# Altium schematic sheet Microcontroller.SchDoc
size A3; SheetNumber: 4; SheetTotal: 5
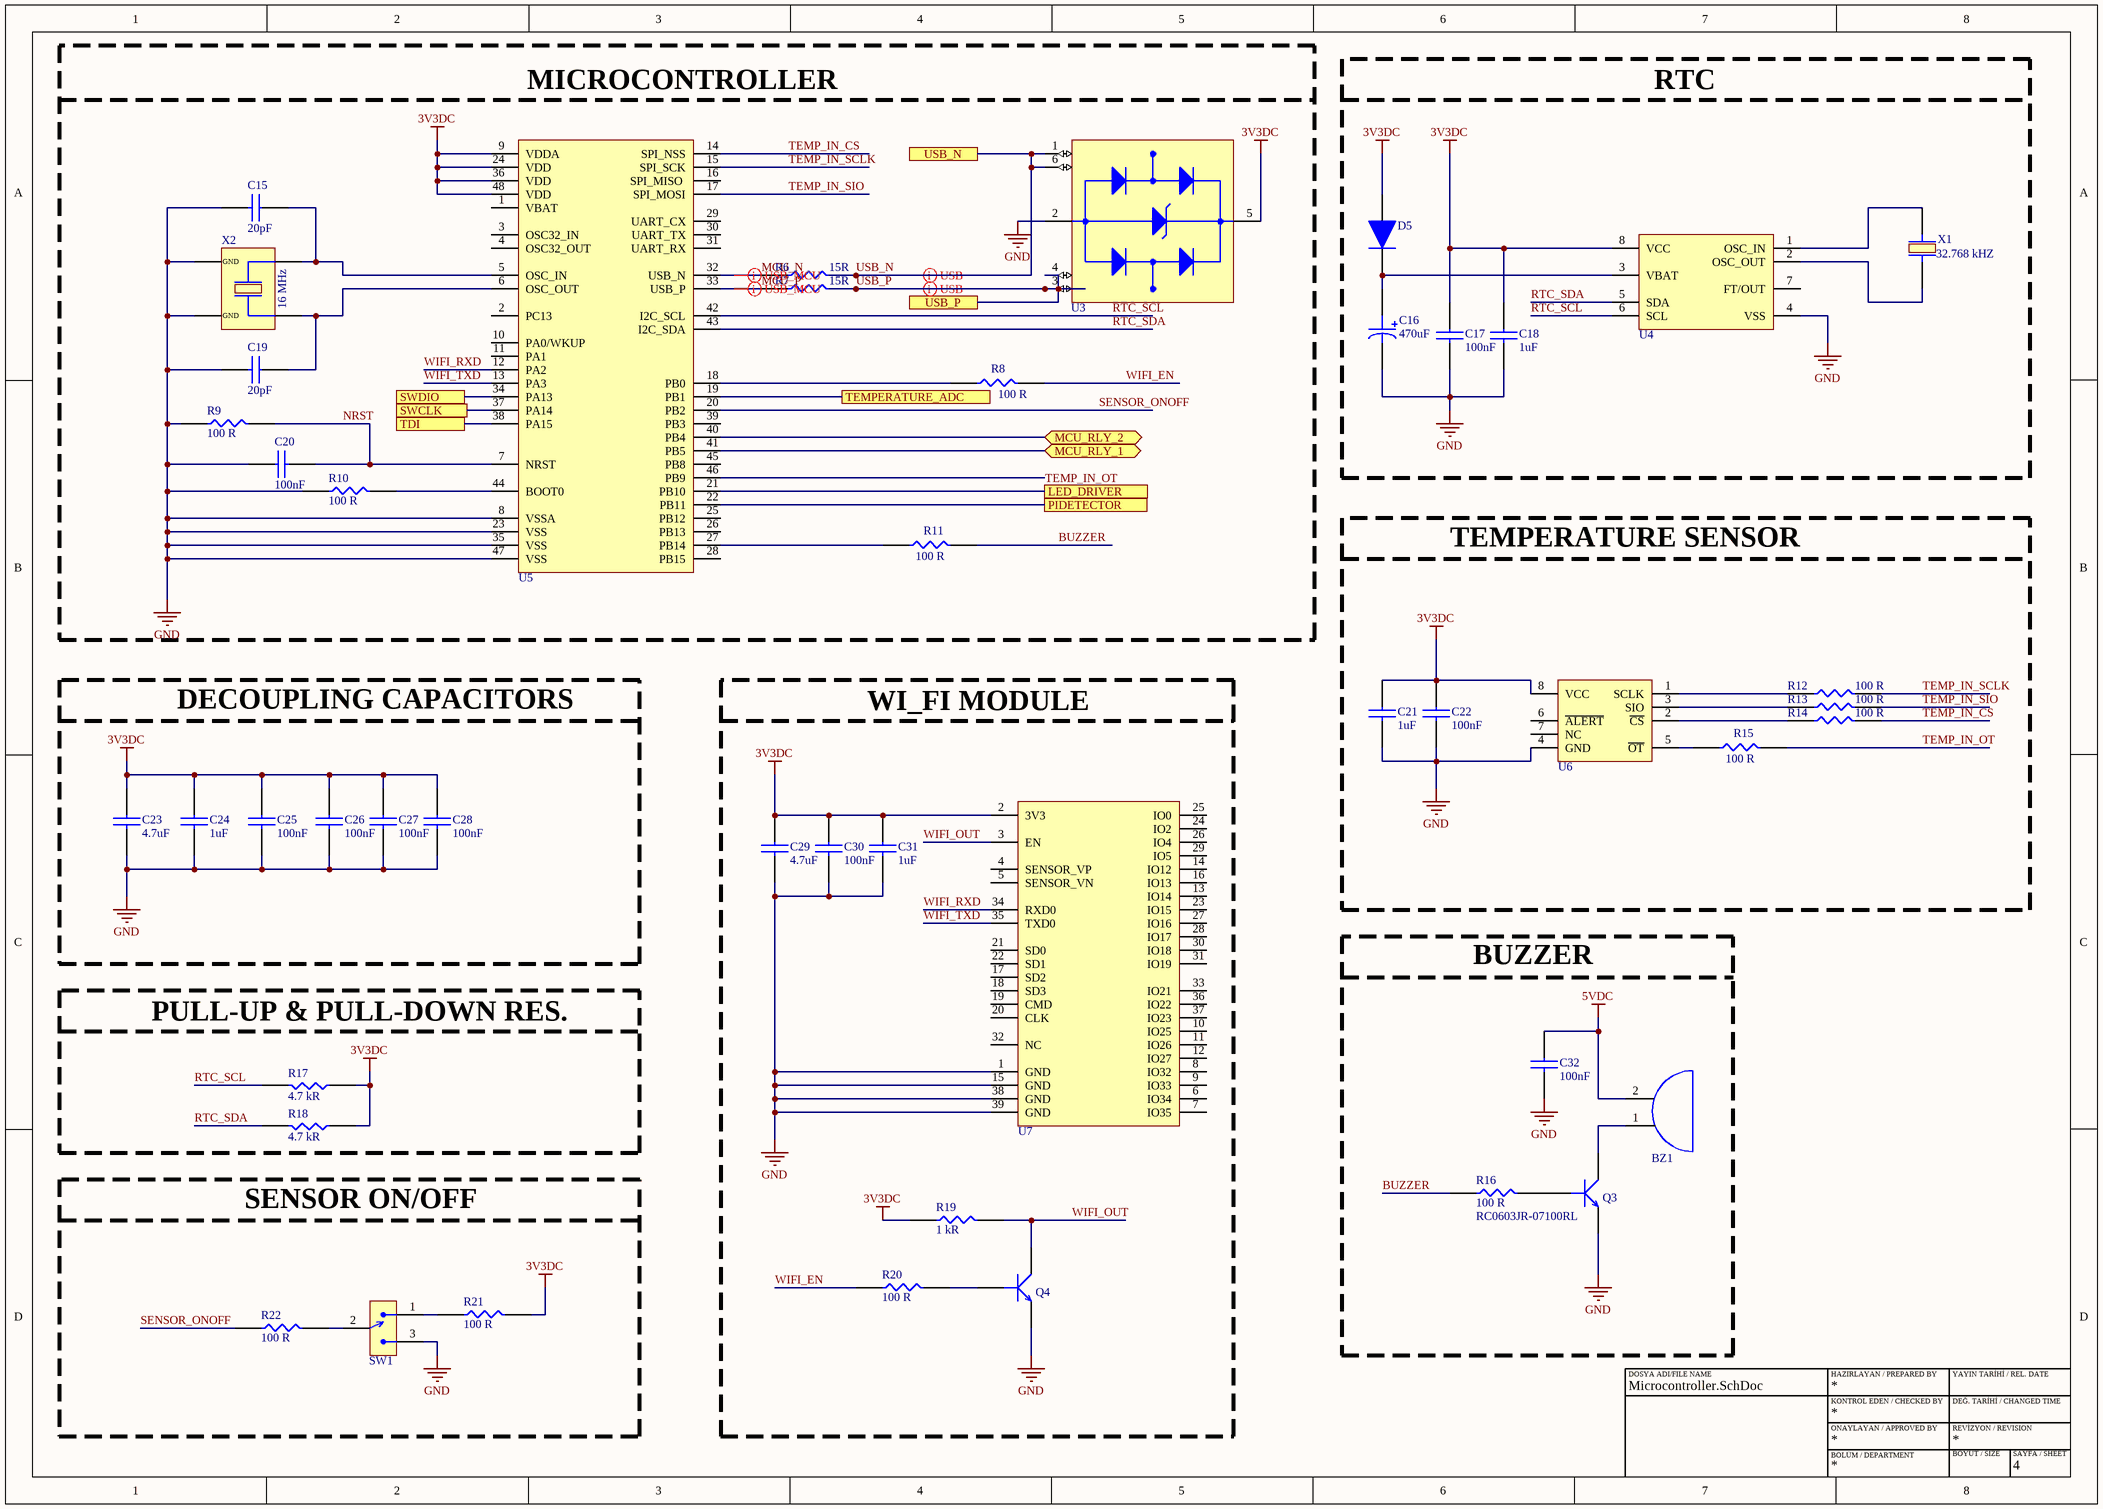
[diagram p0: Microcontroller.SchDoc]

## Parts
BZ1  CMI-9605IC-0580T  [CMI-9605IC-0580T]  (value not drawn)
C15  value 20pF  [CAP_0603]  (hidden comment: CL10C200JB8NNNC)
C16  value 470uF  [CAP_RADIAL_D10_P5]  (hidden comment: ESH477M050AH4AA)
C17  value 100nF  [CAP_0805]  (hidden comment: CL21B104KBCNNNC)
C18  value 1uF  [CAP_0805]  (hidden comment: CL21B105KBFNNNE)
C19  value 20pF  [CAP_0603]  (hidden comment: CL10C200JB8NNNC)
C20  value 100nF  [CAP_0805]  (hidden comment: CL21B104KBCNNNC)
C21  value 1uF  [CAP_0805]  (hidden comment: CL21B105KBFNNNE)
C22  value 100nF  [CAP_0805]  (hidden comment: CL21B104KBCNNNC)
C23  value 4.7uF  [CAP_0805]  (hidden comment: CL21A475KAQNNNE)
C24  value 1uF  [CAP_0805]  (hidden comment: CL21B105KBFNNNE)
C25  value 100nF  [CAP_0805]  (hidden comment: CL21B104KBCNNNC)
C26  value 100nF  [CAP_0805]  (hidden comment: CL21B104KBCNNNC)
C27  value 100nF  [CAP_0805]  (hidden comment: CL21B104KBCNNNC)
C28  value 100nF  [CAP_0805]  (hidden comment: CL21B104KBCNNNC)
C29  value 4.7uF  [CAP_0805]  (hidden comment: CL21A475KAQNNNE)
C30  value 100nF  [CAP_0805]  (hidden comment: CL21B104KBCNNNC)
C31  value 1uF  [CAP_0805]  (hidden comment: CL21B105KBFNNNE)
C32  value 100nF  [CAP_0805]  (hidden comment: CL21B104KBCNNNC)
D5  1N4148WS  [SOD323F]  (value not drawn)
Q3  MMBT3904.7.F  [SOT-23F]  (value not drawn)
Q4  MMBT3904.7.F  [SOT-23F]  (value not drawn)
R6  value 15R  [RES_0603]  (hidden comment: RC0603JR-0715RL)
R7  value 15R  [RES_0603]  (hidden comment: RC0603JR-0715RL)
R8  value 100 R  [RES_0603]  (hidden comment: RC0603JR-07100RL)
R9  value 100 R  [RES_0603]  (hidden comment: RC0603JR-07100RL)
R10  value 100 R  [RES_0603]  (hidden comment: RC0603JR-07100RL)
R11  value 100 R  [RES_0603]  (hidden comment: RC0603JR-07100RL)
R12  value 100 R  [RES_0603]  (hidden comment: RC0603JR-07100RL)
R13  value 100 R  [RES_0603]  (hidden comment: RC0603JR-07100RL)
R14  value 100 R  [RES_0603]  (hidden comment: RC0603JR-07100RL)
R15  value 100 R  [RES_0603]  (hidden comment: RC0603JR-07100RL)
R16  RC0603JR-07100RL  value 100 R  [RES_0603]
R17  value 4.7 kR  [RES_0603]  (hidden comment: RC0603FR-074K7L)
R18  value 4.7 kR  [RES_0603]  (hidden comment: RC0603FR-074K7L)
R19  value 1 kR  [RES_0603]  (hidden comment: RMCF0603FT1K00)
R20  value 100 R  [RES_0603]  (hidden comment: RC0603JR-07100RL)
R21  value 100 R  [RES_0603]  (hidden comment: RC0603JR-07100RL)
R22  value 100 R  [RES_0603]  (hidden comment: RC0603JR-07100RL)
SW1  EG1215AA  [EG1215AA]  (value not drawn)
U3  USBLC6-2SC6  [SOT23-6L]  (value not drawn)
U4  M41T00M6F  [SOIC-8]  (value not drawn)
U5  STM32F103C6T6A  [LQFP-48]  (value not drawn)
U6  MAX6662MSA+  [SOIC-8]  (value not drawn)
U7  ESP32-WROOM-32E  [ESP32-32E]  (value not drawn)
X1  Operating Frequency-Nom: 32.768 kHZ  [ABS05]  (hidden comment: ABS05-32.768KHZ-T)
X2  Operating Frequency-Nom: 16 MHz  [ECS]  (hidden comment: ECS-160-20-30B-TR)

## Blocks framed on the sheet
MICROCONTROLLER: C15 C19 C20 R6-R11 U3 U5 X2
RTC: C16-C18 D5 U4 X1
TEMPERATURE SENSOR: C21 C22 R12-R15 U6
DECOUPLING CAPACITORS: C23-C28
WI_FI MODULE: C29-C31 Q4 R19 R20 U7
PULL-UP & PULL-DOWN RES.: R17 R18
BUZZER: BZ1 C32 Q3 R16
SENSOR ON/OFF: R21 R22 SW1

## Ports
LED_DRIVER, MCU_RLY_1 (bidir), MCU_RLY_2 (bidir), PIDETECTOR, SWCLK, SWDIO, TDI, TEMPERATURE_ADC, USB_N, USB_P

## Nets
3V3DC: C17.2 C18.2 C21.2 C22.2 C23.2 C24.2 C25.2 C26.2 C27.2 C28.2 C29.2 C30.2 C31.2 D5.2 R17.2 R18.2 R19.1 R21.2 U3.5(VBUS) U4.8(VCC) U5.9(VDDA) U5.24(VDD) U5.36(VDD) U5.48(VDD) U6.8(VCC) U7.2(3V3)
5VDC: BZ1.2 C32.2
GND: C15.1 C16.2 C17.1 C18.1 C19.1 C20.2 C21.1 C22.1 C23.1 C24.1 C25.1 C26.1 C27.1 C28.1 C29.1 C30.1 C31.1 C32.1 Q3.2(E) Q4.2(E) R9.1 R10.1 SW1.3 U3.2(GND) U4.4(VSS) U5.8(VSSA) U5.23(VSS) U5.35(VSS) U5.47(VSS) U6.4(GND) U7.1(GND) U7.15(GND) U7.38(GND) U7.39(GND) X2.2(GND) X2.4(GND)
BUZZER: R11.2 R16.1
LED_DRIVER: U5.21(PB10) ; port LED_DRIVER
MCU_N: R6.1 U5.32(USB_N)
MCU_P: R7.1 U5.33(USB_P)
MCU_RLY_1: U5.41(PB5) ; port MCU_RLY_1
MCU_RLY_2: U5.40(PB4) ; port MCU_RLY_2
NRST: C20.1 R9.2 U5.7(NRST)
PIDETECTOR: U5.22(PB11) ; port PIDETECTOR
RTC_SCL: R17.1 U4.6(SCL) U5.42(I2C_SCL)
RTC_SDA: R18.1 U4.5(SDA) U5.43(I2C_SDA)
SENSOR_ONOFF: R22.1 U5.20(PB2)
SWCLK: U5.37(PA14) ; port SWCLK
SWDIO: U5.34(PA13) ; port SWDIO
TDI: U5.38(PA15) ; port TDI
TEMP_IN_CS: R14.2 U5.14(SPI_NSS)
TEMP_IN_OT: R15.2 U5.46(PB9)
TEMP_IN_SCLK: R12.2 U5.15(SPI_SCK)
TEMP_IN_SIO: R13.2 U5.17(SPI_MOSI)
TEMPERATURE_ADC: U5.19(PB1) ; port TEMPERATURE_ADC
USB_N: R6.2 U3.1(I/O1_IN) U3.6(I/O1_OUT) ; port USB_N
USB_P: R7.2 U3.3(I/O2_IN) U3.4(I/O2_OUT) ; port USB_P
WIFI_EN: R8.2 R20.1
WIFI_OUT: Q4.3(C) R19.2 U7.3(EN)
WIFI_RXD: U5.12(PA2) U7.34(RXD0)
WIFI_TXD: U5.13(PA3) U7.35(TXD0)
NetBZ1_1: BZ1.1 Q3.3(C)
NetC15_2: C15.2 U5.5(OSC_IN) X2.3
NetC16_1: C16.1 D5.1 U4.3(VBAT)
NetC19_2: C19.2 U5.6(OSC_OUT) X2.1
NetQ3_1: Q3.1(B) R16.2
NetQ4_1: Q4.1(B) R20.2
NetR8_1: R8.1 U5.18(PB0)
NetR10_2: R10.2 U5.44(BOOT0)
NetR11_1: R11.1 U5.27(PB14)
NetR12_1: R12.1 U6.1(SCLK)
NetR13_1: R13.1 U6.3(SIO)
NetR14_1: R14.1 U6.2(~{CS})
NetR15_1: R15.1 U6.5(~{OT})
NetR21_1: R21.1 SW1.1
NetR22_2: R22.2 SW1.2
NetU4_1: U4.1(OSC_IN) X1.2
NetU4_2: U4.2(OSC_OUT) X1.1

Not connected (* = marked no-connect by the designer): U4 7(FT/OUT); U5 1(VBAT) 2(PC13) 3(OSC32_IN) 4(OSC32_OUT) 10(PA0/WKUP) 11(PA1) 16(SPI_MISO_) 25(PB12) 26(PB13) 28(PB15) 29(UART_CX) 30(UART_TX) 31(UART_RX) 39(PB3) 45(PB8); U6 6(~{ALERT}) 7(NC); U7 4(SENSOR_VP) 5(SENSOR_VN) 6(IO34) 7(IO35) 8(IO32) 9(IO33) 10(IO25) 11(IO26) 12(IO27) 13(IO14) 14(IO12) 16(IO13) 17(SD2) 18(SD3) 19(CMD) 20(CLK) 21(SD0) 22(SD1) 23(IO15) 24(IO2) 25(IO0) 26(IO4) 27(IO16) 28(IO17) 29(IO5) 30(IO18) 31(IO19) 32(NC) 33(IO21) 36(IO22) 37(IO23)

## Layout directives
differential pair: MCU_N, MCU_P, USB_N, USB_P

## Notes on the sheet
- DOSYA ADI/FILE NAME
- HAZIRLAYAN / PREPARED BY
- YAYIN TARİHİ / REL. DATE
- KONTROL EDEN / CHECKED BY
- ONAYLAYAN / APPROVED BY
- BÖLÜM / DEPARTMENT
- DEĞ. TARİHİ / CHANGED TIME
- REVİZYON / REVISION
- BOYUT / SIZE
- SAYFA / SHEET

## Library data of the parts
BZ1 = CMI-9605IC-0580T: Buzzers Indicator, Internally Driven Magnetic 5 V 30mA 2.7kHz 80dB @ 5V, 10cm Surface Mount Solder Pads; Manufacturer: Same Sky; Manufacturer Part Number: CMI-9705-0580-SMT-TR; Design by: MCP; Supplier: Mouser; Supplier Part Number: 490-CMI97050580SMTTR; RoHS: No; Stock: 10698; Pricing: 1=1.68, 10=1.4, 50=1.25, 100=1.18, 1000=1.08, 10000=1.08 (USD); ComponentLink1URL: https://datasheet.octopart.com/CMI-9705-0580-SMT-TR-Same-Sky-datasheet-182049007.pdf?src-supplier=Future+Electronics; ComponentLink1Description: https://datasheet.octopart.com/CMI-9705-0580-SMT-TR-Same-Sky-datasheet-182049007.pdf?src-supplier=Future+Electronics; ComponentLink2URL: https://www.cuidevices.com/product/resource/digikeypdf/cmi-9705-0580-smt-tr.pdf?src-supplier=Digikey; ComponentLink2Description: https://www.cuidevices.com/product/resource/digikeypdf/cmi-9705-0580-smt-tr.pdf?src-supplier=Digikey; ComponentLink3URL: https://datasheet.octopart.com/CMI-9705-0580-SMT-TR-CUI-Devices-datasheet-175926888.pdf?src-supplier=Master+Electronics; ComponentLink3Description: https://datasheet.octopart.com/CMI-9705-0580-SMT-TR-CUI-Devices-datasheet-175926888.pdf?src-supplier=Master+Electronics; ComponentLink4URL: https://datasheet.octopart.com/CMI-9705-0580-SMT-TR-CUI-Devices-datasheet-175926213.pdf?src-supplier=Electro+Sonic; ComponentLink4Description: https://datasheet.octopart.com/CMI-9705-0580-SMT-TR-CUI-Devices-datasheet-175926213.pdf?src-supplier=Electro+Sonic; ComponentLink5URL: https://datasheet.octopart.com/CMI-9705-0580-SMT-TR-Same-Sky-datasheet-188930177.pdf?src-supplier=TME; ComponentLink5Description: https://datasheet.octopart.com/CMI-9705-0580-SMT-TR-Same-Sky-datasheet-188930177.pdf?src-supplier=TME; Case/Package: CMI-9605IC
C15 C19 = CAP CER 20pF 0603: CAP CER 20pF 5% 0603; Manufacturer: Samsung; Dielectric Material: Ceramic; Multilayer: Yes; Rated DC Voltage (URdc): 50V; Temperature Characteristics Code: C0G; Supplier: Mouser; Supplier Part Number: 187-CL10C200JB8NNNC; Manufacturer Part Number: CL10C200JB8NNNC; RoHS: Yes; Category: Ceramic Capacitors; Stock: 18618; Pricing: 1=0.1, 10=0.034, 50=0.034, 100=0.02, 1000=0.013, 10000=0.007 (USD); Mounting Technology: Surface Mount; Pins: 2; Package Shape: Rectangular; Case/Package: 0603; Terminal Finish: Nickel; Min Operating Temperature: -55°C; Max Operating Temperature: 125°C; JESD-609 Code: e3; Capacitor Type: Ceramic; Tolerance  (fill in as +-): 5%; Package Style: SMTMeter; Packaging: Tape and Reel; Tolerance (fill in as +-): 5%; Termination: Wraparound; Length: 1.6mm; Width: 0.8mm; Height: 0.9mm; Reach SVHC Compliant: Yes; RoHS Compliant: Yes; ComponentLink1URL: https://datasheet.ciiva.com:443/pdfs/VipMasterIC/IC/SEMS/SEMS-S-A0008520096/SEMS-S-A0008519968-1.pdf?src-supplier=IHS+Markit; ComponentLink1Description: https://datasheet.ciiva.com:443/pdfs/VipMasterIC/IC/SEMS/SEMS-S-A0008520096/SEMS-S-A0008519968-1.pdf?src-supplier=IHS+Markit; ComponentLink2URL: https://datasheet.ciiva.com/26877/getdatasheetpartid-640634-26877974.pdf?src-supplier=Verical; ComponentLink2Description: https://datasheet.ciiva.com/26877/getdatasheetpartid-640634-26877974.pdf?src-supplier=Verical; ComponentLink3URL: https://datasheet.ciiva.com/26310/mlcc-catalogdownload2013-eng-26310315.pdf?src-supplier=Distrelec; ComponentLink3Description: https://datasheet.ciiva.com/26310/mlcc-catalogdownload2013-eng-26310315.pdf?src-supplier=Distrelec
C16 = CAP ALU ELEC 470uF 50V: CAP ALU ELEC 470uF 50V 20%; Manufacturer: KEMET; Designed by: MCP; Dielectric Material: Aluminium; Polarity: Polarized; Leakage Current: 235uA; Ripple Current: 630mA; Tan Delta: 0.12; Supplier: Mouser; Supplier Part Number: 80-ESH477M050AH4AA; Manufacturer Part Number: ESH477M050AH4AA; RoHS: Yes; Category: Capacitors; Stock: 682; Pricing: 1=0.54, 10=0.338, 50=0.338, 100=0.251, 1000=0.194, 10000=0.174 (USD); Mounting Technology: Through Hole; Pins: 2; Package Shape: Cylindrical; Min Operating Temperature: -40°C; Max Operating Temperature: 105°C; Capacitor Type: Aluminium; Tolerance  (fill in as +-): 20%; Packaging: Bulk; Tolerance (fill in as +-): 20%; Rated DC Voltage (URdc): 50V; Termination: Wire; Reach SVHC Compliant: Yes; RoHS Compliant: Yes; ComponentLink1URL: https://datasheet.ciiva.com:443/pdfs/VipMasterIC/IC/KEME/KEME-S-A0008512286/KEME-S-A0008512286-1.pdf?src-supplier=IHS+Markit; ComponentLink1Description: https://datasheet.ciiva.com:443/pdfs/VipMasterIC/IC/KEME/KEME-S-A0008512286/KEME-S-A0008512286-1.pdf?src-supplier=IHS+Markit; ComponentLink2URL: https://api.kemet.com/component-edge/download/datasheet/ESH477M050AH4AA.pdf?src-supplier=Digikey; ComponentLink2Description: https://api.kemet.com/component-edge/download/datasheet/ESH477M050AH4AA.pdf?src-supplier=Digikey; ComponentLink3URL: https://datasheet.octopart.com/ESH477M050AH4AA-KEMET-datasheet-130075338.pdf?src-supplier=Newark; ComponentLink3Description: https://datasheet.octopart.com/ESH477M050AH4AA-KEMET-datasheet-130075338.pdf?src-supplier=Newark; ComponentLink4URL: https://datasheet.octopart.com/ESH477M050AH4AA-KEMET-datasheet-157246171.pdf?src-supplier=Element14; ComponentLink4Description: https://datasheet.octopart.com/ESH477M050AH4AA-KEMET-datasheet-157246171.pdf?src-supplier=Element14
C17 C20 C22 C25-C28 C30 C32 = CAP CER 100nF 0805: CAP CER 100nF 10% 0805; Manufacturer: Samsung; Designed by: MCP; Dielectric Material: Ceramic; Multilayer: Yes; Rated DC Voltage (URdc): 50V; Temperature Characteristics Code: X7R; Supplier: Mouser; Supplier Part Number: 187-CL21B104KBCNNNC; Manufacturer Part Number: CL21B104KBCNNNC; RoHS: Yes; Category: Ceramic Capacitors; Stock: 24455; Pricing: 1=0.1, 10=0.008, 50=0.008, 100=0.008, 1000=0.008, 10000=0.006 (USD); Mounting Technology: Surface Mount; Pins: 2; Package Shape: Rectangular; Case/Package: 0805; Terminal Finish: Nickel; Min Operating Temperature: -55°C; Max Operating Temperature: 125°C; JESD-609 Code: e3; Capacitor Type: Ceramic; Tolerance  (fill in as +-): 10%; Package Style: SMTMeter; Packaging: Tape and Reel; Tolerance (fill in as +-): 10%; Termination: Wraparound; Length: 2mm; Width: 1.25mm; Height: 0.95mm; Reach SVHC Compliant: Yes; RoHS Compliant: Yes; ComponentLink1URL: https://datasheet.ciiva.com:443/pdfs/VipMasterIC/IC/SEMS/SEMS-S-A0008521003/SEMS-S-A0008521039-1.pdf?src-supplier=IHS+Markit; ComponentLink1Description: https://datasheet.ciiva.com:443/pdfs/VipMasterIC/IC/SEMS/SEMS-S-A0008521003/SEMS-S-A0008521039-1.pdf?src-supplier=IHS+Markit; ComponentLink2URL: https://datasheet.ciiva.com/25710/cl21b104kbcnnnc-25710182.pdf?src-supplier=Digikey; ComponentLink2Description: https://datasheet.ciiva.com/25710/cl21b104kbcnnnc-25710182.pdf?src-supplier=Digikey; ComponentLink3URL: https://datasheet.ciiva.com/29199/454152-da-01-en-vs-kondensator-0805-29199814.pdf?src-supplier=Conrad; ComponentLink3Description: https://datasheet.ciiva.com/29199/454152-da-01-en-vs-kondensator-0805-29199814.pdf?src-supplier=Conrad
C18 C21 C24 C31 = CAP CER 1uF 0805: CAP CER 1uF 10% 0805; Manufacturer: Samsung; Dielectric Material: Ceramic; Multilayer: Yes; Rated DC Voltage (URdc): 50V; Temperature Characteristics Code: X7R; Designed by: MCP; Supplier: Mouser; Supplier Part Number: 187-CL21B105KBFNNNE; Manufacturer Part Number: CL21B105KBFNNNE; RoHS: Yes; Category: Ceramic Capacitors; Stock: 340112; Pricing: 1=0.1, 10=0.024, 50=0.024, 100=0.016, 1000=0.013, 10000=0.011 (USD); Mounting Technology: Surface Mount; Pins: 2; Package Shape: Rectangular; Case/Package: 0805; Terminal Finish: Nickel; Min Operating Temperature: -55°C; Max Operating Temperature: 125°C; JESD-609 Code: e3; Capacitor Type: Ceramic; Tolerance  (fill in as +-): 10%; Package Style: SMTMeter; Packaging: Tape and Reel; Tolerance (fill in as +-): 10%; Termination: Wraparound; Length: 2mm; Width: 1.25mm; Height: 1.35mm; Reach SVHC Compliant: Yes; RoHS Compliant: Yes; ComponentLink1URL: https://datasheet.ciiva.com:443/pdfs/VipMasterIC/IC/SEMS/SEMS-S-A0008524728/SEMS-S-A0008523023-1.pdf?src-supplier=IHS+Markit; ComponentLink1Description: https://datasheet.ciiva.com:443/pdfs/VipMasterIC/IC/SEMS/SEMS-S-A0008524728/SEMS-S-A0008523023-1.pdf?src-supplier=IHS+Markit; ComponentLink2URL: https://datasheet.ciiva.com/16449/cl21b105kbfnnne-16449003.pdf?src-supplier=Future+Electronics; ComponentLink2Description: https://datasheet.ciiva.com/16449/cl21b105kbfnnne-16449003.pdf?src-supplier=Future+Electronics; ComponentLink3URL: https://datasheet.ciiva.com/25800/cl21b105kbfnnne-25800291.pdf?src-supplier=Digikey; ComponentLink3Description: https://datasheet.ciiva.com/25800/cl21b105kbfnnne-25800291.pdf?src-supplier=Digikey
C23 C29 = CAP CER 4.7uF 0805: CAP CER 4.7uF 10% 0805; Manufacturer: Samsung; Dielectric Material: Ceramic; Multilayer: Yes; Rated DC Voltage (URdc): 25V; Temperature Characteristics Code: X5R; Designed by: MCP; Supplier: Mouser; Supplier Part Number: 187-CL21A475KAQNNNE; Manufacturer Part Number: CL21A475KAQNNNE; RoHS: Yes; Category: Ceramic Capacitors; Stock: 107749; Pricing: 1=0.1, 10=0.057, 50=0.057, 100=0.034, 1000=0.022, 10000=0.012 (USD); Mounting Technology: Surface Mount; Pins: 2; Package Shape: Rectangular; Case/Package: 0805; Terminal Finish: Nickel; Min Operating Temperature: -55°C; Max Operating Temperature: 85°C; JESD-609 Code: e3; Capacitor Type: Ceramic; Tolerance  (fill in as +-): 10%; Package Style: SMTMeter; Packaging: Tape and Reel; Tolerance (fill in as +-): 10%; Termination: Wraparound; Length: 2mm; Width: 1.25mm; Height: 1.4mm; Reach SVHC Compliant: Yes; RoHS Compliant: Yes; ComponentLink1URL: https://datasheet.ciiva.com:443/pdfs/VipMasterIC/IC/SEMS/SEMS-S-A0008528919/SEMS-S-A0008528938-1.pdf?src-supplier=IHS+Markit; ComponentLink1Description: https://datasheet.ciiva.com:443/pdfs/VipMasterIC/IC/SEMS/SEMS-S-A0008528919/SEMS-S-A0008528938-1.pdf?src-supplier=IHS+Markit; ComponentLink2URL: https://datasheet.ciiva.com/25798/cl21a475kaqnnne-25798882.pdf?src-supplier=Digikey; ComponentLink2Description: https://datasheet.ciiva.com/25798/cl21a475kaqnnne-25798882.pdf?src-supplier=Digikey
D5 = 1N4148WS: Diode,150mA, 75V V; Manufacturer: onsemi; Designed by: MCP; Diode Element Material: SILICON; Package Body Material: Plastic; Diode Type: RECTIFIER; Number of Elements: 1; Rep Pk Reverse Voltage-Max: 100V; Reverse Recovery Time-Max: 0.004us; Forward Voltage: 1V; Qualification Status: Not Qualified; Supplier: Mouser; Supplier Part Number: 512-1N4148WS; Manufacturer Part Number: 1N4148WS; RoHS: Yes; Category: Rectifier Diodes; Stock: 1003660; Pricing: 1=0.11, 10=0.066, 50=0.066, 100=0.062, 1000=0.041, 10000=0.019 (USD); Pins: 2; Package Shape: Rectangular; Max Operating Temperature: 150°C; JESD-30 Code: R-PDSO-F2; Max Output current: 150mA; Package Style: SMALL OUTLINEMeter; Surface Mount: Yes; Terminal Form: Flat; Terminal Position: DUAL; Moisture Sensitivity Level: 1; Reach SVHC Compliant: Yes; RoHS Compliant: Yes; ComponentLink1URL: https://datasheet.ciiva.com:443/pdfs/VipMasterIC/IC/ONSM/ONSM-S-A0003392874/ONSM-S-A0003585195-1.pdf?src-supplier=IHS+Markit; ComponentLink1Description: https://datasheet.ciiva.com:443/pdfs/VipMasterIC/IC/ONSM/ONSM-S-A0003392874/ONSM-S-A0003585195-1.pdf?src-supplier=IHS+Markit
Q3 Q4 = MMBT3904.7.F: Small Signal Bipolar Transistor, 0.2A I(C), 40V V(BR)CEO, 1-Element, NPN, Silicon; Manufacturer: Diodes Zetex; Manufacturer Part Number: MMBT3904-7-F; Package Body Material: Plastic; Additional Feature: HIGH RELIABILITY; Max Collector Current: 200mA; DC Current Gain-Min (hFE): 30; Number of Elements: 1; Power Dissipation-Max (Abs): 300mW; Time @ Peak Reflow Temperature-Max (s): 40s; Transistor Application: SWITCHING; Frequency: 300MHz; Turn-off Time-Max (toff): 250ns; Turn-on Time-Max (ton): 70ns; Qualification Status: Not Qualified; Designed by: MCP; Supplier: Mouser; Supplier Part Number: 621-MMBT3904-F; RoHS: Yes; Category: BJTs; Stock: 1474086; Pricing: 1=0.1, 10=0.063, 50=0.063, 100=0.042, 1000=0.025, 10000=0.016 (USD); Pins: 3; Package Shape: Rectangular; Terminal Finish: Tin; Transistor Element Material: SILICON; Max Operating Temperature: 150°C; JESD-609 Code: e3; Polarity/Channel Type: NPN; Collector-emitter Voltage-Max: 40V; JESD-30 Code: R-PDSO-G3; Moisture Sensitivity Level: 1; Package Style: SMALL OUTLINEMeter; Peak Reflow Temperature (Cel): 260°C; Surface Mount: Yes; Terminal Form: Gull Wing; Terminal Position: DUAL; Reach SVHC Compliant: Yes; RoHS Compliant: Yes; ComponentLink1URL: https://datasheet.ciiva.com:443/pdfs/VipMasterIC/IC/DIOD/DIOD-S-A0003133141/DIOD-S-A0003133141-1.pdf?src-supplier=IHS+Markit; ComponentLink1Description: https://datasheet.ciiva.com:443/pdfs/VipMasterIC/IC/DIOD/DIOD-S-A0003133141/DIOD-S-A0003133141-1.pdf?src-supplier=IHS+Markit; ComponentLink2URL: https://datasheet.ciiva.com/11201/ds30036-11201778.pdf?src-supplier=Avnet; ComponentLink2Description: https://datasheet.ciiva.com/11201/ds30036-11201778.pdf?src-supplier=Avnet; ComponentLink3URL: https://datasheet.ciiva.com/15138/getdatasheetpartid-53265-15138780.pdf?src-supplier=Verical; ComponentLink3Description: https://datasheet.ciiva.com/15138/getdatasheetpartid-53265-15138780.pdf?src-supplier=Verical; ComponentLink4URL: https://datasheet.ciiva.com/22711/1915516-22711750.pdf?src-supplier=Element14; ComponentLink4Description: https://datasheet.ciiva.com/22711/1915516-22711750.pdf?src-supplier=Element14; ComponentLink5URL: https://datasheet.ciiva.com/11198/ds30036-11198999.pdf?src-supplier=Avnet; ComponentLink5Description: https://datasheet.ciiva.com/11198/ds30036-11198999.pdf?src-supplier=Avnet; ComponentLink6URL: https://datasheet.ciiva.com/6361/ds30036-6361256.pdf?src-supplier=Digikey; ComponentLink6Description: https://datasheet.ciiva.com/6361/ds30036-6361256.pdf?src-supplier=Digikey; ComponentLink7URL: https://datasheet.ciiva.com/6361/ds30036-6361254.pdf?src-supplier=Digikey; ComponentLink7Description: https://datasheet.ciiva.com/6361/ds30036-6361254.pdf?src-supplier=Digikey
R6 R7 = RES 15 OHM 0603: Fixed Resistor, Metal Glaze/thick Film, 0.1W, 15ohm, 75V, 5% +/-Tol, 100ppm/Cel, Surface Mount, 0603; Manufacturer: Yageo; Additional Feature: LASER TRIMMABLE; Power: 100mW; Rated Temperature: 70°C; Temperature Coefficient (ppm/Cel): 100; Package Height: 0.45mm; Package Length: 1.6mm; Package Width: 0.8mm; Supplier: Mouser; Supplier Part Number: 603-RC0603JR-0715RL; Manufacturer Part Number: RC0603JR-0715RL; RoHS: Yes; Category: Chip SMD Resistors; Stock: 814360; Pricing: 1=0.1, 10=0.007, 50=0.007, 100=0.006, 1000=0.003, 10000=0.001 (USD); Mounting Technology: Surface Mount; Pins: 2; Package Shape: Rectangular; Case/Package: 0603; Terminal Finish: Nickel; Min Operating Temperature: -55°C; Max Operating Temperature: 155°C; Tolerance: 5%; JESD-609 Code: e3; Resistor Type: FIXED RESISTOR; Construction: Chip; Packaging: Tape and Reel; Technology: METAL GLAZE/THICK FILM; Termination: Wraparound; Working Voltage: 75V; Reach SVHC Compliant: Yes; RoHS Compliant: Yes; ComponentLink1URL: https://datasheet.ciiva.com:443/pdfs/VipMasterIC/IC/YAGO/YAGO-S-A0008145938/YAGO-S-A0008145938-1.pdf?src-supplier=IHS+Markit; ComponentLink1Description: https://datasheet.ciiva.com:443/pdfs/VipMasterIC/IC/YAGO/YAGO-S-A0008145938/YAGO-S-A0008145938-1.pdf?src-supplier=IHS+Markit; ComponentLink2URL: https://datasheet.ciiva.com/2453/pyu-r-int-thick-7-2453085.pdf?src-supplier=Digikey; ComponentLink2Description: https://datasheet.ciiva.com/2453/pyu-r-int-thick-7-2453085.pdf?src-supplier=Digikey; ComponentLink3URL: https://datasheet.ciiva.com/2453/pyu-r-int-thick-7-2453086.pdf?src-supplier=Digikey; ComponentLink3Description: https://datasheet.ciiva.com/2453/pyu-r-int-thick-7-2453086.pdf?src-supplier=Digikey; ComponentLink4URL: https://datasheet.ciiva.com/2453/pyu-r-int-thick-7-2453087.pdf?src-supplier=Digikey; ComponentLink4Description: https://datasheet.ciiva.com/2453/pyu-r-int-thick-7-2453087.pdf?src-supplier=Digikey; ComponentLink5URL: https://datasheet.ciiva.com/7746/443971-7746445.pdf?src-supplier=Element14; ComponentLink5Description: https://datasheet.ciiva.com/7746/443971-7746445.pdf?src-supplier=Element14; ComponentLink6URL: https://datasheet.ciiva.com/7746/443971-7746446.pdf?src-supplier=Element14; ComponentLink6Description: https://datasheet.ciiva.com/7746/443971-7746446.pdf?src-supplier=Element14
R8-R16 R20-R22 = RES 100 OHM 0603: Fixed Resistor, Metal Glaze/thick Film, 0.1W, 100ohm, 75V, 5% +/-Tol, 100ppm/Cel, Surface Mount, 0603; Manufacturer: Yageo; Additional Feature: LASER TRIMMABLE; Power: 100mW; Rated Temperature: 70°C; Temperature Coefficient (ppm/Cel): 100; Package Height: 0.45mm; Package Length: 1.6mm; Package Width: 0.8mm; Supplier: Mouser; Supplier Part Number: 603-RC0603JR-07100RL; Manufacturer Part Number: RC0603JR-07100RL; RoHS: Yes; Category: Chip SMD Resistors; Stock: 208852; Pricing: 1=0.1, 10=0.008, 50=0.008, 100=0.007, 1000=0.006, 10000=0.002 (USD); Mounting Technology: Surface Mount; Pins: 2; Package Shape: Rectangular; Case/Package: 0603; Terminal Finish: Nickel; Min Operating Temperature: -55°C; Max Operating Temperature: 155°C; Tolerance: 5%; JESD-609 Code: e3; Resistor Type: FIXED RESISTOR; Construction: Chip; Packaging: Tape and Reel; Technology: METAL GLAZE/THICK FILM; Termination: Wraparound; Working Voltage: 75V; Reach SVHC Compliant: Yes; RoHS Compliant: Yes; ComponentLink1URL: https://datasheet.ciiva.com:443/pdfs/VipMasterIC/IC/YAGO/YAGO-S-A0008145938/YAGO-S-A0008145938-1.pdf?src-supplier=IHS+Markit; ComponentLink1Description: https://datasheet.ciiva.com:443/pdfs/VipMasterIC/IC/YAGO/YAGO-S-A0008145938/YAGO-S-A0008145938-1.pdf?src-supplier=IHS+Markit; ComponentLink2URL: https://datasheet.ciiva.com/7746/443971-7746425.pdf?src-supplier=Element14; ComponentLink2Description: https://datasheet.ciiva.com/7746/443971-7746425.pdf?src-supplier=Element14; ComponentLink3URL: https://datasheet.ciiva.com/7746/443971-7746426.pdf?src-supplier=Element14; ComponentLink3Description: https://datasheet.ciiva.com/7746/443971-7746426.pdf?src-supplier=Element14; ComponentLink4URL: https://datasheet.ciiva.com/8883/pyu-rc0603-51-rohs-l-4-8883047.pdf?src-supplier=Avnet; ComponentLink4Description: https://datasheet.ciiva.com/8883/pyu-rc0603-51-rohs-l-4-8883047.pdf?src-supplier=Avnet; ComponentLink5URL: https://datasheet.ciiva.com/15189/getdatasheetpartid-325207-15189846.pdf?src-supplier=Verical; ComponentLink5Description: https://datasheet.ciiva.com/15189/getdatasheetpartid-325207-15189846.pdf?src-supplier=Verical
R17 R18 = RES 4K7 OHM 0603: Fixed Resistor, Metal Glaze/thick Film, 0.1W, 4700ohm, 75V, 5% +/-Tol, 100ppm/Cel, Surface Mount, 0603; Manufacturer: Yageo; Manufacturer Part Number: RC0603JR-074K7L; Additional Feature: LASER TRIMMABLE; Power: 100mW; Rated Temperature: 70°C; Temperature Coefficient (ppm/Cel): 100; Package Height: 0.45mm; Package Length: 1.6mm; Package Width: 0.8mm; Supplier: Mouser; Supplier Part Number: 603-RC0603JR-074K7L; RoHS: Yes; Category: Chip SMD Resistors; Stock: 298096; Pricing: 1=0.1, 10=0.008, 50=0.008, 100=0.006, 1000=0.005, 10000=0.002 (USD); Mounting Technology: Surface Mount; Pins: 2; Package Shape: Rectangular; Case/Package: 0603; Terminal Finish: Nickel; Min Operating Temperature: -55°C; Max Operating Temperature: 155°C; Tolerance: 5%; JESD-609 Code: e3; Resistor Type: FIXED RESISTOR; Construction: Chip; Packaging: Tape and Reel; Technology: METAL GLAZE/THICK FILM; Termination: Wraparound; Working Voltage: 75V; Reach SVHC Compliant: Yes; RoHS Compliant: Yes; ComponentLink1URL: https://datasheet.ciiva.com:443/pdfs/VipMasterIC/IC/YAGO/YAGO-S-A0008145938/YAGO-S-A0008145938-1.pdf?src-supplier=IHS+Markit; ComponentLink1Description: https://datasheet.ciiva.com:443/pdfs/VipMasterIC/IC/YAGO/YAGO-S-A0008145938/YAGO-S-A0008145938-1.pdf?src-supplier=IHS+Markit; ComponentLink2URL: https://datasheet.ciiva.com/46412/443971-46412858.pdf?src-supplier=Element14; ComponentLink2Description: https://datasheet.ciiva.com/46412/443971-46412858.pdf?src-supplier=Element14
R19 = RES 1K OHM 0603: Fixed Resistor, Metal Glaze/thick Film, 0.1W, 1000ohm, 75V, 1% +/-Tol, 100ppm/Cel, Surface Mount, 0603; Manufacturer: Stackpole Electronics; Power: 100mW; Rated Temperature: 70°C; Temperature Coefficient (ppm/Cel): 100; Package Height: 0.45mm; Package Length: 1.55mm; Package Width: 0.8mm; Reference Standard: AEC-Q200; Supplier: Mouser; Supplier Part Number: 708-RMCF0603FT1K00; Manufacturer Part Number: RMCF0603FT1K00; RoHS: Yes; Category: Chip SMD Resistors; Stock: 204581; Pricing: 1=0.1, 10=0.018, 50=0.018, 100=0.008, 1000=0.004, 10000=0.002 (USD); Mounting Technology: Surface Mount; Pins: 2; Package Shape: Rectangular; Case/Package: 0603; Terminal Finish: Nickel; Min Operating Temperature: -55°C; Max Operating Temperature: 155°C; Tolerance: 1%; JESD-609 Code: e3; Resistor Type: FIXED RESISTOR; Construction: Rectangular; Packaging: Tape and Reel; Technology: METAL GLAZE/THICK FILM; Termination: Wraparound; Working Voltage: 75V; Reach SVHC Compliant: Yes; RoHS Compliant: Yes; ComponentLink1URL: https://datasheet.ciiva.com:443/pdfs/VipMasterIC/IC/SEIE/SEIE-S-A0009541969/SEIE-S-A0009541969-1.pdf?src-supplier=IHS+Markit; ComponentLink1Description: https://datasheet.ciiva.com:443/pdfs/VipMasterIC/IC/SEIE/SEIE-S-A0009541969/SEIE-S-A0009541969-1.pdf?src-supplier=IHS+Markit; ComponentLink2URL: https://datasheet.octopart.com/RMCF0603FT1K00-Stackpole-Electronics-datasheet-11547379.pdf?src-supplier=Future+Electronics; ComponentLink2Description: https://datasheet.octopart.com/RMCF0603FT1K00-Stackpole-Electronics-datasheet-11547379.pdf?src-supplier=Future+Electronics; ComponentLink3URL: https://www.seielect.com/catalog/SEI-Packaging.pdf?src-supplier=Avnet; ComponentLink3Description: https://www.seielect.com/catalog/SEI-Packaging.pdf?src-supplier=Avnet; ComponentLink4URL: https://www.seielect.com/catalog/SEI-Packaging.pdf?src-supplier=Arrow+Electronics; ComponentLink4Description: https://www.seielect.com/catalog/SEI-Packaging.pdf?src-supplier=Arrow+Electronics; ComponentLink5URL: http://www.seielect.com/Catalog/SEI-rmc.pdf?src-supplier=Future+Electronics; ComponentLink5Description: http://www.seielect.com/Catalog/SEI-rmc.pdf?src-supplier=Future+Electronics; ComponentLink6URL: https://www.seielect.com/catalog/SEI-Packaging.pdf?src-supplier=Verical; ComponentLink6Description: https://www.seielect.com/catalog/SEI-Packaging.pdf?src-supplier=Verical; ComponentLink7URL: https://www.seielect.com/catalog/SEI-RMCF_RMCP.pdf?src-supplier=Avnet; ComponentLink7Description: https://www.seielect.com/catalog/SEI-RMCF_RMCP.pdf?src-supplier=Avnet; ComponentLink8URL: https://www.seielect.com/catalog/sei-rmcf_rmcp.pdf?src-supplier=Digikey; ComponentLink8Description: https://www.seielect.com/catalog/sei-rmcf_rmcp.pdf?src-supplier=Digikey; ComponentLink9URL: https://www.seielect.com/catalog/SEI-Packaging.pdf?src-supplier=Quest; ComponentLink9Description: https://www.seielect.com/catalog/SEI-Packaging.pdf?src-supplier=Quest; ComponentLink10URL: https://datasheet.octopart.com/RMCF0603FT1K00-Stackpole-Electronics-datasheet-189104164.pdf?src-supplier=Master+Electronics; ComponentLink10Description: https://datasheet.octopart.com/RMCF0603FT1K00-Stackpole-Electronics-datasheet-189104164.pdf?src-supplier=Master+Electronics
SW1 = EG1215AA: Slide Switch; Manufacturer: E-Switch; Design by: MCP; Supplier: Mouser; Supplier Part Number: 612-EG1215AA; Manufacturer Part Number: EG1215AA; RoHS: Yes; Category: LDO; Pricing: 1=0.95, 10=0.812, 50=0.756, 100=0.674, 1000=0.559, 10000=0.496 (USD); ComponentLink1URL: https://media.digikey.com/pdf/Data%20Sheets/E-Switch%20PDFs/EG1215_Series_Ds.pdf?src-supplier=Digikey; ComponentLink1Description: https://media.digikey.com/pdf/Data%20Sheets/E-Switch%20PDFs/EG1215_Series_Ds.pdf?src-supplier=Digikey; ComponentLink2URL: http://www.farnell.com/datasheets/2645007.pdf?src-supplier=Farnell; ComponentLink2Description: http://www.farnell.com/datasheets/2645007.pdf?src-supplier=Farnell; ComponentLink3URL: https://datasheet.octopart.com/EG1215AA-E-Switch-datasheet-156105969.pdf?src-supplier=Future+Electronics; ComponentLink3Description: https://datasheet.octopart.com/EG1215AA-E-Switch-datasheet-156105969.pdf?src-supplier=Future+Electronics; ComponentLink4URL: https://datasheet.octopart.com/EG1215AA-E-Switch-datasheet-101745667.pdf?src-supplier=Electro+Sonic; ComponentLink4Description: https://datasheet.octopart.com/EG1215AA-E-Switch-datasheet-101745667.pdf?src-supplier=Electro+Sonic
U3 = USB PROTECTION: Trans Voltage Suppressor Diode, 5V V(RWM), Unidirectional, 1 Element, Silicon; Manufacturer: STMicroelectronics; Package Body Material: Plastic; Additional Feature: HIGH RELIABILITY; Min Breakdown Voltage: 6V; Number of Elements: 1; Clamping Voltage-Max: 17V; Reference Standard: IEC-61000-4-2; Qualification Status: Not Qualified; Supplier: Mouser; Supplier Part Number: 511-USBLC6-2SC6; Manufacturer Part Number: USBLC6-2SC6; RoHS: Yes; Category: TVS Diodes; Stock: 155753; Pricing: 1=0.36, 10=0.243, 50=0.243, 100=0.163, 1000=0.114, 10000=0.075 (USD); Pins: 6; Package Shape: Rectangular; Terminal Finish: Tin; Diode Element Material: SILICON; Min Operating Temperature: -40°C; Max Operating Temperature: 125°C; JESD-609 Code: e3; Polarity: Unidirectional; Package Style: SMALL OUTLINEMeter; Diode Type: TRANS VOLTAGE SUPPRESSOR; JESD-30 Code: R-PDSO-G6; Moisture Sensitivity Level: 1; Rep Pk Reverse Voltage-Max: 5V; Surface Mount: Yes; Technology: AVALANCHE; Terminal Form: Gull Wing; Terminal Position: DUAL; Peak Reflow Temperature (Cel): 260°C; Reach SVHC Compliant: Yes; RoHS Compliant: Yes; ComponentLink1URL: https://datasheet.ciiva.com:443/pdfs/VipMasterIC/IC/SGST/SGSTS30336/SGSTS30336-1.pdf?src-supplier=IHS+Markit; ComponentLink1Description: https://datasheet.ciiva.com:443/pdfs/VipMasterIC/IC/SGST/SGSTS30336/SGSTS30336-1.pdf?src-supplier=IHS+Markit; ComponentLink2URL: https://datasheet.ciiva.com/1268/1690354-1268384.pdf?src-supplier=Element14; ComponentLink2Description: https://datasheet.ciiva.com/1268/1690354-1268384.pdf?src-supplier=Element14; ComponentLink3URL: https://datasheet.ciiva.com/4508/cd00050750-113117-4508433.pdf?src-supplier=Mouser; ComponentLink3Description: https://datasheet.ciiva.com/4508/cd00050750-113117-4508433.pdf?src-supplier=Mouser; ComponentLink4URL: https://datasheet.ciiva.com/15143/getdatasheetpartid-148465-15143789.pdf?src-supplier=Verical; ComponentLink4Description: https://datasheet.ciiva.com/15143/getdatasheetpartid-148465-15143789.pdf?src-supplier=Verical; ComponentLink5URL: https://datasheet.ciiva.com/16200/cd00050750-16200026.pdf?src-supplier=Future+Electronics; ComponentLink5Description: https://datasheet.ciiva.com/16200/cd00050750-16200026.pdf?src-supplier=Future+Electronics; ComponentLink6URL: https://datasheet.ciiva.com/41444/001184109-da-01-en-ic-esd-protecti-usblc6-2sc6-sot-23-6-stm-41444156.pdf?src-supplier=Conrad; ComponentLink6Description: https://datasheet.ciiva.com/41444/001184109-da-01-en-ic-esd-protecti-usblc6-2sc6-sot-23-6-stm-41444156.pdf?src-supplier=Conrad
U4 = M41T00M6F: Real Time Clock, Volatile, CMOS, PDSO8; Manufacturer: STMicroelectronics; Package Body Material: Plastic; Clock Frequency: 32kHz; Package Equivalence Code: SOP8,.25; Power Supplies: 2/5.5V; Max Supply Voltage: 5.5V; Min Supply Voltage: 2V; Time @ Peak Reflow Temperature-Max (s): 40s; Qualification Status: Not Qualified; Designed by: MCP; Supplier: Mouser; Supplier Part Number: 511-M41T00M6F; Manufacturer Part Number: M41T00M6F; RoHS: Yes; Category: Real Time Clocks; Stock: 10196; Pricing: 1=3.35, 10=2.52, 50=2.31, 100=2.08, 1000=1.85, 10000=1.78 (USD); Case/Package: SOIC; Pins: 8; Terminal Finish: Nickel; Package Shape: Rectangular; Min Operating Temperature: -40°C; Max Operating Temperature: 85°C; JESD-609 Code: e4; Package Style: SMALL OUTLINEMeter; Surface Mount: Yes; JESD-30 Code: R-PDSO-G8; Moisture Sensitivity Level: 1; Peak Reflow Temperature (Cel): 260°C; Technology: CMOS; Terminal Form: Gull Wing; Terminal Position: DUAL; Length: 4.9mm; Width: 3.9mm; Height - Seated (Max): 1.75mm; Terminal Pitch: 1.27mm; Reach SVHC Compliant: Yes; RoHS Compliant: Yes; Temperature Grade: INDUSTRIAL; ComponentLink1URL: https://datasheet.ciiva.com:443/pdfs/VipMasterIC/IC/SGST/SGST-S-A0001364830/SGST-S-A0001364830-1.pdf?src-supplier=IHS+Markit; ComponentLink1Description: https://datasheet.ciiva.com:443/pdfs/VipMasterIC/IC/SGST/SGST-S-A0001364830/SGST-S-A0001364830-1.pdf?src-supplier=IHS+Markit; ComponentLink2URL: https://datasheet.ciiva.com/16213/cd00001542-16213654.pdf?src-supplier=Future+Electronics; ComponentLink2Description: https://datasheet.ciiva.com/16213/cd00001542-16213654.pdf?src-supplier=Future+Electronics; ComponentLink3URL: https://datasheet.ciiva.com/7630/1837112-7630077.pdf?src-supplier=Element14; ComponentLink3Description: https://datasheet.ciiva.com/7630/1837112-7630077.pdf?src-supplier=Element14; ComponentLink4URL: https://datasheet.ciiva.com/41459/001185345-da-01-en-ic-rtc-srl-512kbit-m41t00m6f-soic-8-stm-41459818.pdf?src-supplier=Conrad; ComponentLink4Description: https://datasheet.ciiva.com/41459/001185345-da-01-en-ic-rtc-srl-512kbit-m41t00m6f-soic-8-stm-41459818.pdf?src-supplier=Conrad
U5 = STM32F103C6T6A: MCU 32-bit STM32F ARM Cortex M3 RISC 32KB Flash 2.5V/3.3V 48-Pin LQFP Tray; Manufacturer: STMicroelectronics; Address Bus Width: 32b; Clock Rate: 16MHz; Frequency: 72MHz; Interface: CAN, I2C, IrDA, LIN, SPI, UART, USART, USB; Max Power Dissipation: 363mW; Max Supply Current: 45mA; Max Supply Voltage: 3.6V; Min Supply Voltage: 2V; Nominal Supply Current: 1.55µA; Number of A/D Converters: 2; Number of ADC Channels: 10; Number of I2C Channels: 1; Number of I/Os: 37; Number of Timers/Counters: 3; Operating Supply Voltage: 3.3V; Oscillator Type: Internal; Peripherals: DMA, I2C, POR, PWM, Temp Sensor, WDT; RAM Size: 10kB; Watchdog Timer: Yes; Designed by: MCP; Supplier: Mouser; Manufacturer Part Number: STM32F103C6T6A; RoHS: Compliant; Category: Microcontrollers; Stock: 2297; Pricing: 1=5.48, 1=4.93, 10=4.2, 10=3.78, 25=3.48, 50=3.87, 100=3.52, 100=3.17, 250=3.02, 500=2.93, 1000=3.23, 1000=2.91, 1500=2.83, 10000=3.14 (USD); Case/Package: LQFP; China RoHS: Compliant; Core Architecture: ARM; Data Bus Width: 32b; Flash Memory Size: 32kB; Height: 1.45mm; Lead Free: Lead Free; Length: 7mm; Lifecycle Status: Production; Clock Frequency: 72MHz; Max Operating Temperature: 85°C; Memory Size: 32kB; Memory Format: FLASH; Min Operating Temperature: -40°C; Number of Channels: 10; Pins: 48; Number of Programmable I/O: 37; Number of SPI Channels: 1; Number of Terminals: 48; Number of USART Channels: 2; Radiation Hardening: No; REACH SVHC: Yes; Schedule B: 8542310000; Terminal Pitch: 500µm; Width: 7mm; ComponentLink1URL: https://datasheet.octopart.com:443/STM32F103C6T6A-STMicroelectronics-datasheet-44506906.pdf?src-supplier=Newark; ComponentLink1Description: https://datasheet.octopart.com:443/STM32F103C6T6A-STMicroelectronics-datasheet-44506906.pdf?src-supplier=Newark; ComponentLink2URL: https://datasheet.octopart.com:443/STM32F103C6T6A-STMicroelectronics-datasheet-10669440.pdf?src-supplier=Newark; ComponentLink2Description: https://datasheet.octopart.com:443/STM32F103C6T6A-STMicroelectronics-datasheet-10669440.pdf?src-supplier=Newark; ComponentLink3URL: https://datasheet.octopart.com:443/STM32F103C6T6A-STMicroelectronics-datasheet-16839797.pdf?src-supplier=Newark; ComponentLink3Description: https://datasheet.octopart.com:443/STM32F103C6T6A-STMicroelectronics-datasheet-16839797.pdf?src-supplier=Newark; ComponentLink4URL: https://datasheet.octopart.com:443/STM32F103C6T6A-STMicroelectronics-datasheet-14106722.pdf?src-supplier=iiiC; ComponentLink4Description: https://datasheet.octopart.com:443/STM32F103C6T6A-STMicroelectronics-datasheet-14106722.pdf?src-supplier=iiiC; ComponentLink5URL: https://datasheet.octopart.com:443/STM32F103C6T6A-STMicroelectronics-datasheet-140570543.pdf?src-supplier=Arrow.cn; ComponentLink5Description: https://datasheet.octopart.com:443/STM32F103C6T6A-STMicroelectronics-datasheet-140570543.pdf?src-supplier=Arrow.cn; ComponentLink6URL: https://datasheet.octopart.com:443/STM32F103C6T6A-STMicroelectronics-datasheet-8332104.pdf?src-supplier=Future+Electronics; ComponentLink6Description: https://datasheet.octopart.com:443/STM32F103C6T6A-STMicroelectronics-datasheet-8332104.pdf?src-supplier=Future+Electronics; Supplier Part Number: STM32F103C6T6A
U6 = MAX6662MSA+: Serial Switch/Digital Sensor, 12 Bit(s), 2.50Cel, BICMOS, Rectangular, 8 Pin, Surface Mount; Manufacturer: Maxim; Package Body Material: Plastic; Accuracy-Max (Cel): 2.5°C; Number of Bits: 12; Operating Current-Max: 120uA; Output Interface Type: 3-WIRE; Power Supplies: 3.3/5V; Sensor Type: TEMPERATURE SENSOR,SWITCH/DIGITAL OUTPUT,SERIAL; Body Breadth: 3.9mm; Body Height: 1.72mm; Body Length or Diameter: 4.89mm; Designed by: MCP; Supplier: Mouser; Supplier Part Number: 700-MAX6662MSA; Manufacturer Part Number: MAX6662MSA+; RoHS: Yes; Category: Temperature and Humidity Sensors; Stock: 245; Pricing: 1=4.11, 10=3.52, 50=3.2, 100=3.08, 1000=2.75, 10000=2.75 (USD); Mounting Technology: Surface Mount; Pins: 8; Housing Material: Plastic; Package Shape/Style: Rectangular; Terminal Finish: Tin; Min Operating Temperature: -55°C; Max Operating Temperature: 125°C; JESD-609 Code: e3; Case/Package: SOIC 8; Technology: BICMOS; Termination: Solder; Reach SVHC Compliant: Yes; RoHS Compliant: Yes; ComponentLink1URL: https://datasheet.ciiva.com:443/pdfs/VipMasterIC/IC/MAXM/MAXMS01802/MAXMS01802-1.pdf?src-supplier=IHS+Markit; ComponentLink1Description: https://datasheet.ciiva.com:443/pdfs/VipMasterIC/IC/MAXM/MAXMS01802/MAXMS01802-1.pdf?src-supplier=IHS+Markit; ComponentLink2URL: https://datasheet.ciiva.com/5299/max6662-89142-5299456.pdf?src-supplier=Mouser; ComponentLink2Description: https://datasheet.ciiva.com/5299/max6662-89142-5299456.pdf?src-supplier=Mouser; ComponentLink3URL: https://datasheet.ciiva.com/3277/max6662-3277979.pdf?src-supplier=Avnet; ComponentLink3Description: https://datasheet.ciiva.com/3277/max6662-3277979.pdf?src-supplier=Avnet; ComponentLink4URL: https://datasheet.ciiva.com/2003/max6662-2003390.pdf?src-supplier=Digikey; ComponentLink4Description: https://datasheet.ciiva.com/2003/max6662-2003390.pdf?src-supplier=Digikey
U7 = ESP32-WROOM-32E: ESP32-WROOM-32E 4MB Flash; Manufacturer: Espressif Systems; Manufacturer Part Number: ESP32-DEVKITC-32E; Designed by: MCP; Supplier: Mouser; Supplier Part Number: 356-ESP32-DEVKITC32E; RoHS: No; Category: RF Semiconductors and Devices; Pricing: 1=8.08, 10=8.08, 50=8.08, 100=8.08, 1000=8.08, 10000=8.08 (USD); ComponentLink1URL: https://www.espressif.com/sites/default/files/documentation/espressif_products_ordering_information_en.pdf?src-supplier=Digikey; ComponentLink1Description: https://www.espressif.com/sites/default/files/documentation/espressif_products_ordering_information_en.pdf?src-supplier=Digikey; ComponentLink2URL: https://datasheet.octopart.com/ESP32-DEVKITC-32E-Espressif-Systems-datasheet-165560559.pdf?src-supplier=TME; ComponentLink2Description: https://datasheet.octopart.com/ESP32-DEVKITC-32E-Espressif-Systems-datasheet-165560559.pdf?src-supplier=TME; Case/Package: ESP32-32E
X1 = CRYSTAL 32768kHZ: Parallel - Fundamental Quartz Crystal, 0.032768MHz Nom; Manufacturer: Abracon; Additional Feature: TAPE AND REEL; Drive Level: 0.5uW; Frequency Stability: 0.0072%; Frequency Tolerance: 20ppm; Load Capacitance: 12.5pF; ESR: 90kR; Supplier: Mouser; Supplier Part Number: 815-ABS05-32.768K-T; Manufacturer Part Number: ABS05-32.768KHZ-T; RoHS: Yes; Category: Crystals; Stock: 62245; Pricing: 1=0.66, 10=0.57, 50=0.517, 100=0.496, 1000=0.431, 10000=0.36 (USD); Mounting Technology: Surface Mount; Min Operating Temperature: -40°C; Max Operating Temperature: 85°C; Crystal/Resonator Type: PARALLEL - FUNDAMENTAL; Manufacturer Series: ABS05; Reach SVHC Compliant: Yes; RoHS Compliant: Yes; ComponentLink1URL: https://datasheet.ciiva.com:443/pdfs/VipMasterIC/IC/ABRC/ABRC-S-A0001211237/ABRC-S-A0001211237-1.pdf?src-supplier=IHS+Markit; ComponentLink1Description: https://datasheet.ciiva.com:443/pdfs/VipMasterIC/IC/ABRC/ABRC-S-A0001211237/ABRC-S-A0001211237-1.pdf?src-supplier=IHS+Markit; ComponentLink2URL: https://datasheet.ciiva.com/23810/abs05-23810480.pdf?src-supplier=Newark; ComponentLink2Description: https://datasheet.ciiva.com/23810/abs05-23810480.pdf?src-supplier=Newark; ComponentLink3URL: https://datasheet.ciiva.com/6728/abs05-6728950.pdf?src-supplier=Digikey; ComponentLink3Description: https://datasheet.ciiva.com/6728/abs05-6728950.pdf?src-supplier=Digikey; ComponentLink4URL: https://datasheet.ciiva.com/6728/abs05-6728949.pdf?src-supplier=Digikey; ComponentLink4Description: https://datasheet.ciiva.com/6728/abs05-6728949.pdf?src-supplier=Digikey; ComponentLink5URL: https://datasheet.ciiva.com/16411/abs05-16411149.pdf?src-supplier=Future+Electronics; ComponentLink5Description: https://datasheet.ciiva.com/16411/abs05-16411149.pdf?src-supplier=Future+Electronics
X2 = CRYSTAL 16MHz: Parallel - Fundamental Quartz Crystal, 16MHz Nom; Manufacturer: ECS International; Aging: 5 PPM/FIRST YEAR; Drive Level: 100uW; Frequency Stability: 0.005%; Frequency Tolerance: 30ppm; Load Capacitance: 20pF; ESR: 50R; Supplier: Mouser; Supplier Part Number: 520-ECS-160-20-30B; Manufacturer Part Number: ECS-160-20-30B-TR; RoHS: Yes; Category: Crystals; Stock: 688; Pricing: 1=0.86, 10=0.835, 50=0.835, 100=0.835, 1000=0.72, 10000=0.363 (USD); Mounting Technology: Surface Mount; Terminal Finish: Gold; Min Operating Temperature: -20°C; Max Operating Temperature: 70°C; JESD-609 Code: e4; Crystal/Resonator Type: PARALLEL - FUNDAMENTAL; Reach SVHC Compliant: Yes; RoHS Compliant: Yes; ComponentLink1URL: https://datasheet.ciiva.com:443/pdfs/VipMasterIC/IC/ECSI/ECSI-S-A0003724562/ECSI-S-A0003724562-1.pdf?src-supplier=IHS+Markit; ComponentLink1Description: https://datasheet.ciiva.com:443/pdfs/VipMasterIC/IC/ECSI/ECSI-S-A0003724562/ECSI-S-A0003724562-1.pdf?src-supplier=IHS+Markit; ComponentLink2URL: https://datasheet.ciiva.com/853/ecx-53b-853408.pdf?src-supplier=Digikey; ComponentLink2Description: https://datasheet.ciiva.com/853/ecx-53b-853408.pdf?src-supplier=Digikey; ComponentLink3URL: https://datasheet.ciiva.com/853/ecx-53b-853407.pdf?src-supplier=Digikey; ComponentLink3Description: https://datasheet.ciiva.com/853/ecx-53b-853407.pdf?src-supplier=Digikey; ComponentLink4URL: https://datasheet.ciiva.com/853/ecx-53b-853406.pdf?src-supplier=Digikey; ComponentLink4Description: https://datasheet.ciiva.com/853/ecx-53b-853406.pdf?src-supplier=Digikey